# Altium schematic sheet PowerV3.SchDoc
size A3; SheetNumber: 3; SheetTotal: 5
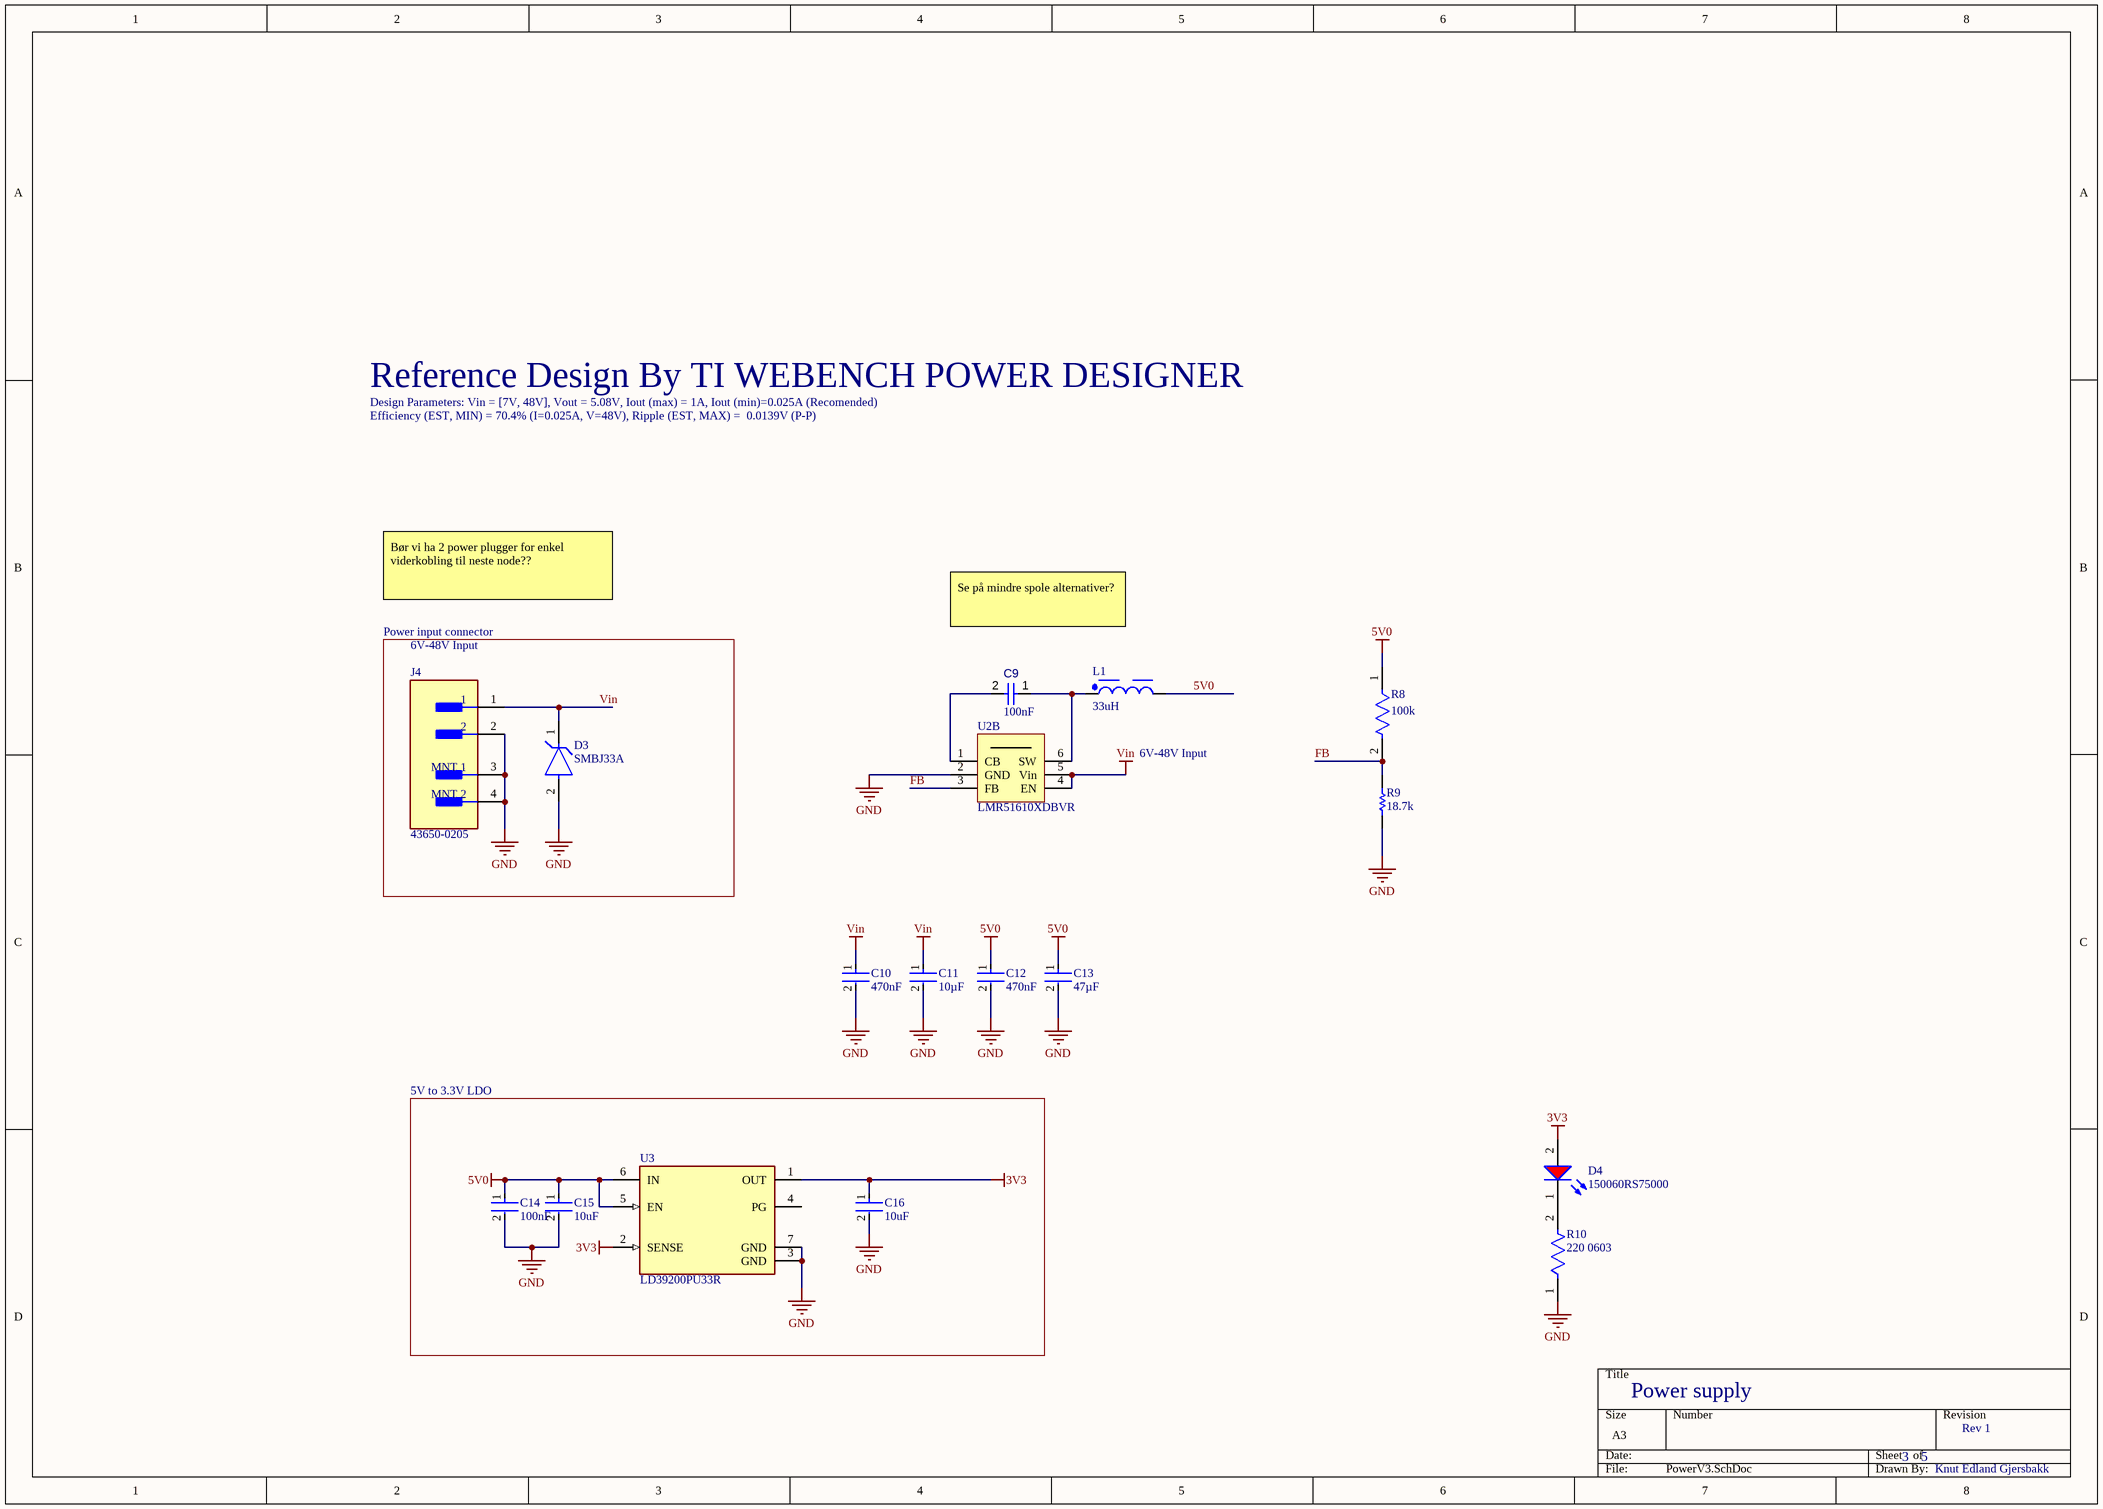
[diagram p0: PowerV3.SchDoc]

## Parts
C9  value 100nF  [CAPC2013X95X50LL10T25]  (hidden comment: Capacitor 100 nF +/-10% 50 V 0805)
C10  value 470nF  [FP-CL21-IPC_A]  (hidden comment: CL21B474KBFNNNF)
C11  value 10µF  [FP-CL31B106KBHNNNE-IPC_A]  (hidden comment: CL31B106KBHNNNE)
C12  value 470nF  [FP-CL21-IPC_A]  (hidden comment: CL21B474KBFNNNF)
C13  value 47µF  [FP-GRM31C-0_2-e0_3_0_8-IPC_B]  (hidden comment: GRM31CR61A476KE15K)
C14  100nF  [FP-CL10-IPC_C]
C15  10uF  [FP-CL10-IPC_C]
C16  10uF  [FP-CL10-IPC_C]
D3  SMBJ33A  [FP-SMBJ-MFG]
D4  150060RS75000  [WL-SMCW_0603_150060xx75000]
J4  43650-0205  [FP-43650-0205-MFG]
L1  value 33uH  [WE-PD_1260P]  (hidden comment: 7447706330)
R8  value 100k  [FP-CRGCQ1206-IPC_A]  (hidden comment: CRGCQ1206F100K)
R9  value 18.7k  [RESC2013X60X40LL20T25]  (hidden comment: ERA-6AEB1872V)
R10  220 0603  [FP-AF0603-IPC_C]
U2  LMR51610XDBVR  [SOT95P280X145-6N]  (part B of 2)
U3  LD39200PU33R  [FP-DFN6-7946637-MFG]

## Blocks framed on the sheet
5V to 3.3V LDO: C14-C16 U3

## Nets
3V3: C16.1 D4.2(A) U3.1(OUT) U3.2(SENSE)
5V0: C12.1 C13.1 C14.1 C15.1 L1.2 R8.1 U3.5(EN) U3.6(IN)
GND: C10.2 C11.2 C12.2 C13.2 C14.2 C15.2 C16.2 D3.2(A) J4.2 J4.3(MNT_1) J4.4(MNT_2) R9.2 R10.1 U2.2(GND) U3.3(GND) U3.7(GND)
Vin: C10.1 C11.1 D3.1(C) J4.1 U2.4(EN) U2.5(Vin)
FB: R8.2 R9.1 U2.3(FB)
NetC9_1: C9.1 L1.1 U2.6(SW)
NetC9_2: C9.2 U2.1(CB)
NetD4_1: D4.1(K) R10.2

Not connected (* = marked no-connect by the designer): U3 4(PG)

## Notes on the sheet
- Reference Design By TI WEBENCH POWER DESIGNER
- Design Parameters: Vin = [7V, 48V], Vout = 5.08V, Iout (max) = 1A, Iout (min)=0.025A (Recomended)
- Efficiency (EST, MIN) = 70.4% (I=0.025A, V=48V), Ripple (EST, MAX) =  0.0139V (P-P)
- Power input connector
- Bør vi ha 2 power plugger for enkel viderkobling til neste node??
- 6V-48V Input
- Se på mindre spole alternativer?
- Power supply
- 3
- 5
- Rev 1
- Knut Edland Gjersbakk

## Library data of the parts
C9 = CMP-001-00018-6: Chip Capacitor, 100 nF, +/- 10%, 50 V, 0805 (2012 Metric); Capacitor Type: Ceramic; Voltage Rating: 50V; Pins: 2; Max Operating Temperature: 125°C; Min Operating Temperature: -55°C; Mounting Technology: SM; Case/Package: 0805; RoHS Compliant: True; Tolerance: 10%
C10 C12 = CMP-001-00098-1: Ceramic Capacitor, Multilayer, Ceramic, 50V, 10% +Tol, 10% -Tol, X7R, 15% TC, 0.47uF, Surface Mount, 0805; Multilayer: Yes; Mounting Technology: Surface Mount; Tolerance (fill in as +-): 10%; Max Operating Temperature: 125°C; Tolerance  (fill in as +-): 10%; Termination: Wraparound; Dielectric Material: Ceramic; Min Operating Temperature: -55°C; Length: 2mm; Terminal Finish: Nickel; Temperature Characteristics Code: X7R; Package Shape: Rectangular; Packaging: Tape and Reel; Pins: 2; Rated DC Voltage (URdc): 50V; Capacitor Type: Ceramic; Width: 1.25mm; JESD-609 Code: e3; Package Style: SMTMeter; Case/Package: 0805; Height: 1.25mm; RoHS Compliant: Yes; Reach SVHC Compliant: Yes
C11 = CMP-001-00099-1: Ceramic Capacitor, Multilayer, Ceramic, 50V, 10% +Tol, 10% -Tol, X7R, 15% TC, 10uF, Surface Mount, 1206; Multilayer: Yes; Dielectric Material: Ceramic; Tolerance (fill in as +-): 10%; Temperature Characteristics Code: X7R; Pins: 2; Termination: Wraparound; Width: 1.6mm; Max Operating Temperature: 125°C; Reach SVHC Compliant: Yes; Package Shape: Rectangular; Min Operating Temperature: -55°C; Length: 3.2mm; Mounting Technology: Surface Mount; Package Style: SMTMeter; Height: 1.8mm; Terminal Finish: Nickel; RoHS Compliant: Yes; Tolerance  (fill in as +-): 10%; JESD-609 Code: e3; Case/Package: 1206; Packaging: Tape and Reel; Capacitor Type: Ceramic; Rated DC Voltage (URdc): 50V
C13 = CMP-001-00103-1: Ceramic Capacitor, Multilayer, Ceramic, 10V, 10% +Tol, 10% -Tol, X5R, 15% TC, 47uF, Surface Mount, 1206; Multilayer: Yes; Max Operating Temperature: 85°C; Case/Package: 1206; JESD-609 Code: e3; Pins: 2; Capacitor Type: Ceramic; Dielectric Material: Ceramic; Packaging: Tape and Reel; Width: 1.6mm; Tolerance  (fill in as +-): 10%; Temperature Characteristics Code: X5R; Package Style: SMTMeter; Reach SVHC Compliant: Yes; Terminal Finish: Nickel; Package Shape: Rectangular; Height: 1.6mm; Termination: Wraparound; Tolerance (fill in as +-): 10%; Length: 3.2mm; Rated DC Voltage (URdc): 10V; Min Operating Temperature: -55°C; RoHS Compliant: Yes; Mounting Technology: Surface Mount
C14 = CMP-13271-002683-1: Cap Ceramic 100nF 16V X7R ±10% Pad SMD 0603 +125°C T/R / CL10B104KO8WPNC; Voltage Rating: 16V; Max Operating Temperature: 125°C; Capacitance: 100nF; Features: Soft Termination; Length: 0.063inch; Packaging: Tape and Reel; Min Operating Temperature: -55°C; Mount: Surface Mount; Case/Package: 0603; Case Code (Metric): 1608; Width: 0.031inch; Ratings: AEC-Q200; Thickness: 0.035inch; Case Code (Imperial): 0603; Tolerance: 10%
C15 C16 = CMP-13271-003287-1: Cap Ceramic 10uF 16V X6S ±20% Pad SMD 0603 +105°C T/R / CL10X106MO8NRNC; Thickness: 0.035inch; Mount: Surface Mount; Length: 0.063inch; Voltage Rating: 16V; Case Code (Imperial): 0603; Case/Package: 0603; Max Operating Temperature: 105°C; Tolerance: 20%; Case Code (Metric): 1608; Width: 0.031inch; Capacitance: 10uF; Min Operating Temperature: -55°C; Packaging: Tape and Reel
D3 = CMP-2000-07095-2: TVS DIODE 33V 53.3V DO214AA; Manufacturer: Littelfuse Inc; Max Junction Temp: +150°C; Number Of Channels: 1; Breakdown Voltage: 36.7V; Peak Pulse Power: 600W; Direction: Unidirectional; Peak Pulse Current: 11.3A; Lead Free: Yes; Height: 2.61mm; Temperature Range Low: -65°C; ComponentLink2URL: https://www.littelfuse.com/~/media/electronics/datasheets/tvs_diodes/littelfuse_tvs_diode_smbj_datasheet.pdf.pdf; Manufacturer Part Number: SMBJ33A; Clamping Voltage: 53.3V; Device Class L1: Circuit Protection; Octopart: https://octopart.com/smbj33a-littelfuse-350829; Device Class L2: TVS Diodes; Digikey Description: TVS DIODE 33V 53.3V DO214AA; Automotive: No; Temperature Range High: +150°C; Package: SMBJ; ComponentLink2Description: Datasheet; Mouser Description: TVS DIODE 33V 53.3V DO214AA; Reverse Standoff Voltage: 33V; Category: Diode; Device Class L3: unset; Temperature: -65°C to +150°C; RoHS: TRUE
D4 = CMP-1426-00001-4: LED Low-Power Uni-Color Red 630nm 2V 2-Pin Chip 0603(1608Metric) T/R; Max Junction Temperature (Tj): 95°C; Dominant Wavelength: 625nm; Lens Style: Clear, Rectangular; Viewing Angle: 140°; Forward Current: 100mA; Max Reverse Voltage (DC): 5V; Luminous Intensity: 250mcd; Test Current: 20mA; Power Dissipation: 72mW; Max Operating Temperature: 85°C; Mount: Surface Mount; Height: 700µm; Packaging: Tape and Reel; REACH SVHC: Unknown; Case Code (Metric): 1608; Peak Wavelength: 630nm; Forward Voltage: 2V; Case/Package: 0603; Color: Red; RoHS: Compliant; Width: 800µm; Reverse Voltage: 5V; Min Operating Temperature: -40°C; Wavelength: 625nm; Case Code (Imperial): 0603; Length: 1.6mm
J4 = CMP-00257-07672643-1: 43650-0205 Conn Wire to Board HDR 2 POS 3mm Solder RA Side Entry Thru-Hole Micro-Fit 3.0™ Tray; Manufacturer Lifecycle Status: ACTIVE; Plating: Tin; Glow Wire Compliant: Compliant; Number of Contacts: 2; Gender: Male; Voltage Rating: 600V; Current Rating: 5A; Lifecycle Status: Production; RoHS: Compliant; Number of Rows: 1; Housing Material: Thermoplastic; Country of Origin: US; Number of Circuits: 2; Halogen Free: Low Halogen; Orientation: Right Angle; Termination: Through Hole; Pitch: 3mm; Contact Material: Brass; Contact Plating: Gold; NexarPartId: 7672643; Number of Positions: 2
L1 = CMP-006-00028-1: General Purpose Inductor; RoHS Compliant: Yes
R8 = CMP-009-00192-1: Fixed Resistor, Metal Glaze/thick Film, 0.25W, 100000ohm, 200V, 1% +/-Tol, 100ppm/Cel, Surface Mount, 1206; Reach SVHC Compliant: Yes; Pins: 2; Resistor Type: FIXED RESISTOR; RoHS Compliant: Yes
R9 = CMP-009-00195-1: Fixed Resistor, Thin Film, 0.125W, 18700ohm, 100V, 0.1% +/-Tol, 25ppm/Cel, Surface Mount, 0805; Rated Temperature: 85°C; Temperature Coefficient (ppm/Cel): 25; Reference Standard: AEC-Q200; Package Width: 1.25mm; Package Length: 2mm; Package Height: 0.5mm; Power: 125mW; Reach SVHC Compliant: Yes; Pins: 2; Technology: THIN FILM; Working Voltage: 100V; Packaging: Tape and Reel; Construction: Rectangular; JESD-609 Code: e3; Termination: Wraparound; RoHS Compliant: Yes; Case/Package: 0805; Min Operating Temperature: -55°C; Tolerance: 0.1%; Mounting Technology: Surface Mount; Resistor Type: FIXED RESISTOR; Terminal Finish: Nickel; Max Operating Temperature: 155°C
R10 = CMP-03412-038529-1: AF0603JR-07220RL Anti-Sulfurated Chip Resistors Automotive Grade 220Ω 5% 100ppm/°C 0603; Max Power Dissipation: 100mW; Resistance: 220R; Width: 0.031inch; Case/Package: 0603; Series: AF; Features: Moisture Resistant; Tolerance: 5%; Resistor Type: Thick Film; Max Operating Temperature: 155°C; Length: 0.063inch; RoHS Compliant: Yes; Lead Free: Lead Free; Packaging: Tape and Reel; Number of Terminations: 2; Temperature Coefficient: 100ppm/°C; Height: 0.022inch; Min Operating Temperature: -55°C
U2 = CMP-019-00059-1: SIMPLE SWITCHER® 4.5-V to 65-V, 1-A synchronous buck converter with 25-µA IQ 6-SOT-23 -40 to 150; Max Supply Voltage: 65V; Min Supply Voltage: 4.5V; Output Current: 1A; Frequency: 400Hz; Pins: 6; Case/Package: SOT-23
U3 = CMP-12153-000011-1: IC REG LINEAR 3.3V 2A 6DFN; Number of Outputs: 1; Max Input Voltage: 6V; Output Type: Fixed; Min Input Voltage: 1.25V; Dropout Voltage: 130mV; Operating Supply Current: 1mA; Number of Regulators: 1; Case/Package: DFN; Packaging: Tape and Reel; Output Current: 2A; Min Operating Temperature: -40°C; Mount: Surface Mount; Output Voltage: 3.3V; Max Operating Temperature: 125°C; Lead Free: Lead Free; Package Quantity: 3000